# EAGLE schematic MM-Qwiic-Snap-1x1 (EAGLE 9.6.2)
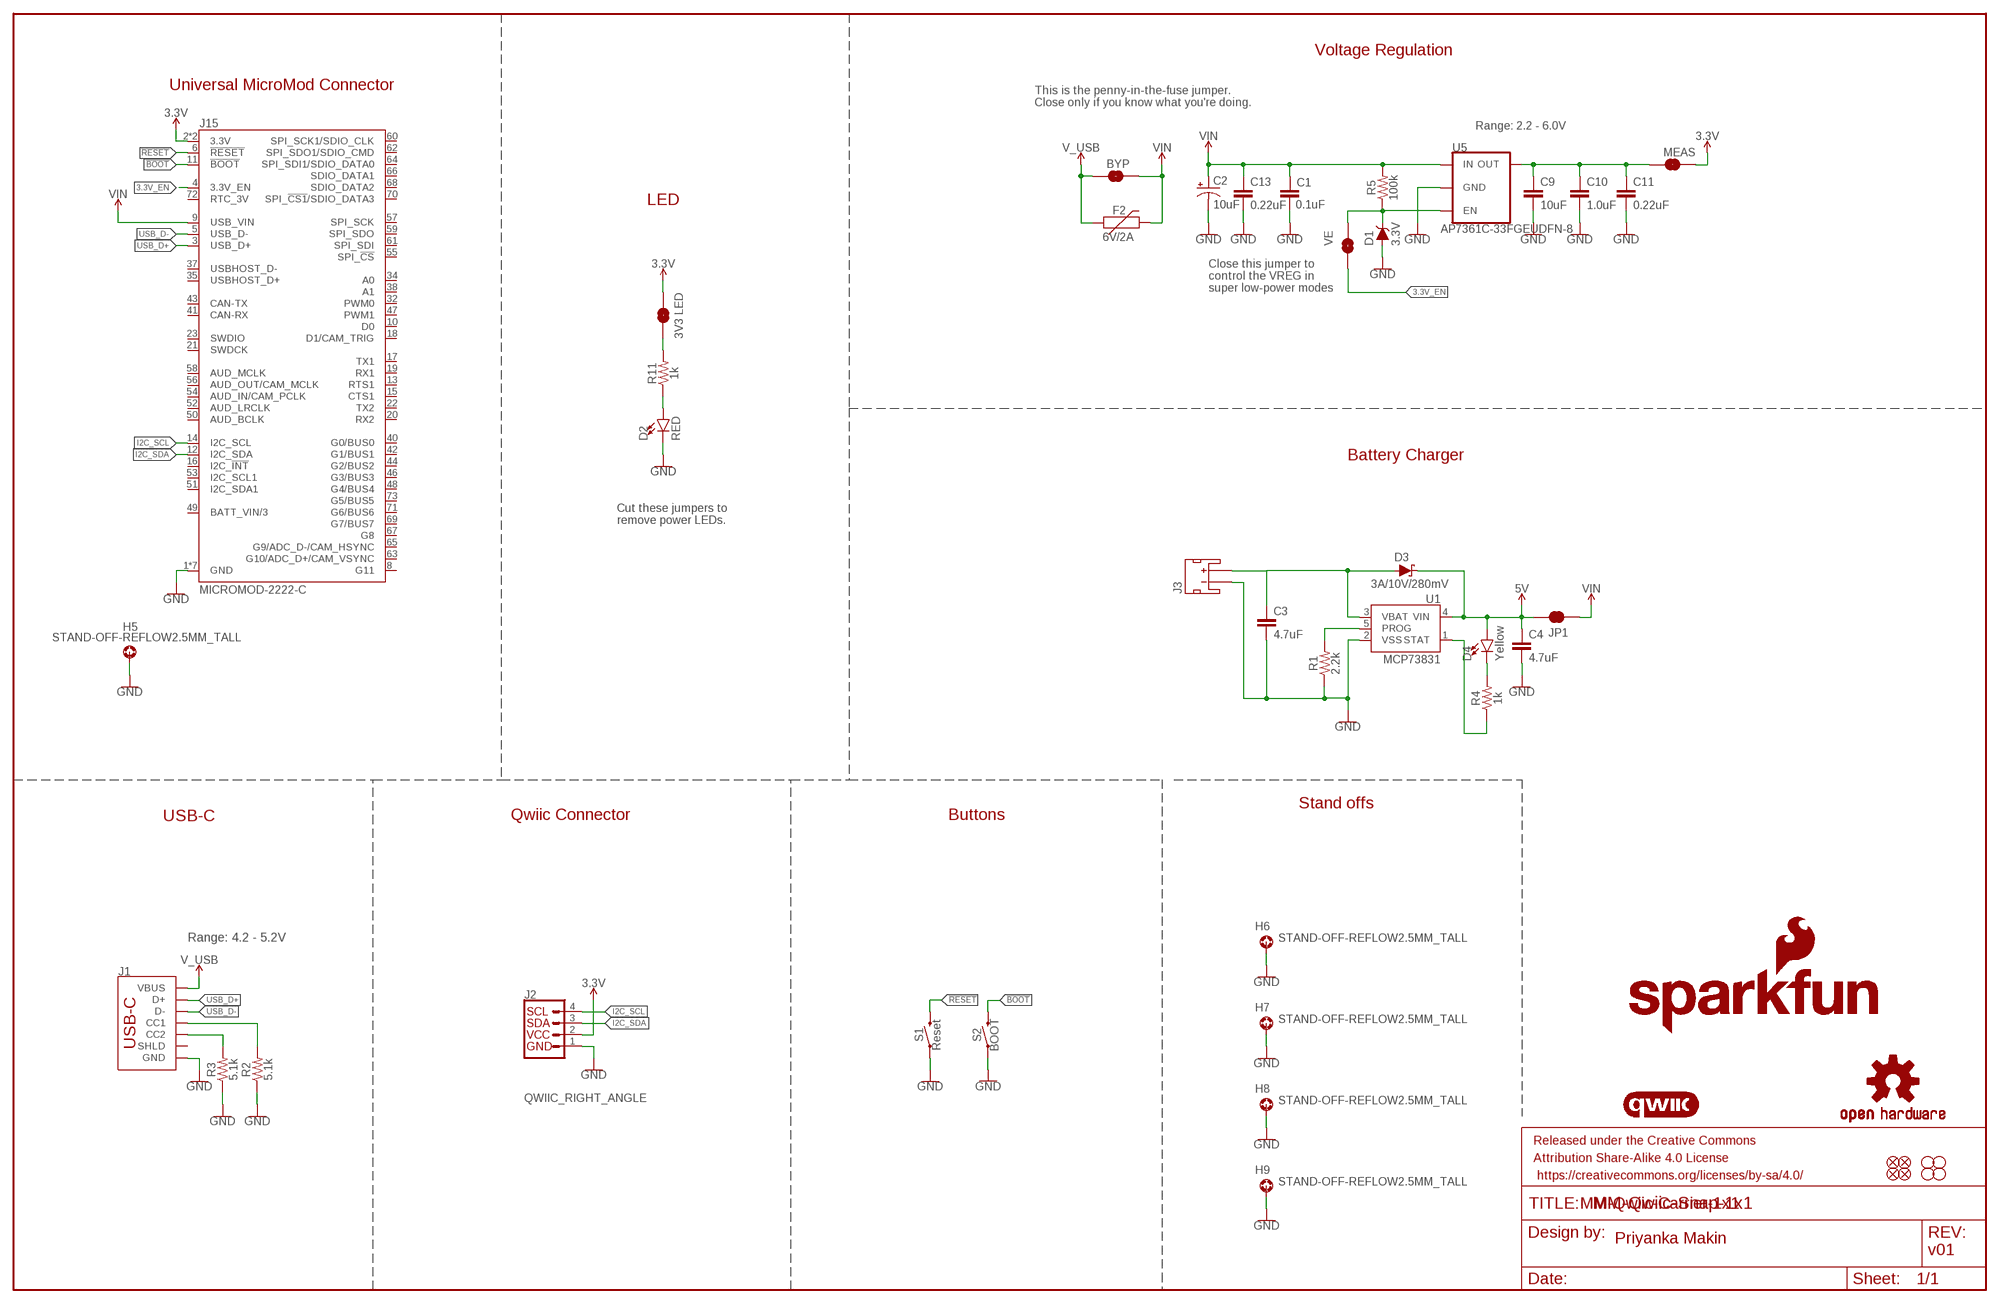
[diagram p0: schematic, sheet 1]

## Parts
BYP  JUMPER-SMT_2_NO_SILK  [SMT-JUMPER_2_NO_SILK]
C1  0.1uF  0.1UF-0603-25V-(+80/-20%)  [0603]
C2  10uF  10UF-POLAR-EIA3216-16V-10%(TANT)  [EIA3216]
C3  4.7uF  4.7UF-0603-35V-(20%)  [0603]
C4  4.7uF  4.7UF-0603-35V-(20%)  [0603]
C9  10uF  10UF-0603-6.3V-20%  [0603]
C10  1.0uF  1.0UF-0603-16V-10%  [0603]
C11  0.22uF  0.22UF-0603-25V-10%  [0603]
C13  0.22uF  0.22UF-0603-25V-10%  [0603]
D1  3.3V  DIODE-ZENER-MM3Z3V3T1G  [SOD-323]
D2  RED  LED-RED0603  [LED-0603]
D3  3A/10V/280mV  DIODE-SCHOTTKY-BAT60A  [SOD-323]
D4  Yellow  LED-YELLOW0603  [LED-0603]
F2  6V/2A  PPTC_6V2A  [1210]
FD1  FIDUCIALUFIDUCIAL  [FIDUCIAL-MICRO]
FD2  FIDUCIALUFIDUCIAL  [FIDUCIAL-MICRO]
FD3  FIDUCIALUFIDUCIAL  [FIDUCIAL-MICRO]
FD4  FIDUCIALUFIDUCIAL  [FIDUCIAL-MICRO]
FRAME1  FRAME-LEDGER  [CREATIVE_COMMONS]
H1  STAND-OFF  [STAND-OFF]
H2  STAND-OFF  [STAND-OFF]
H3  STAND-OFF  [STAND-OFF]
H4  STAND-OFF  [STAND-OFF]
H5  STAND-OFF-REFLOW2.5MM_TALL  [STAND-OFF-REFLOW-M2.5]
H6  STAND-OFF-REFLOW2.5MM_TALL  [STAND-OFF-REFLOW-M2.5]
H7  STAND-OFF-REFLOW2.5MM_TALL  [STAND-OFF-REFLOW-M2.5]
H8  STAND-OFF-REFLOW2.5MM_TALL  [STAND-OFF-REFLOW-M2.5]
H9  STAND-OFF-REFLOW2.5MM_TALL  [STAND-OFF-REFLOW-M2.5]
J1  USB_C_2-LAYER_PADS  [USB-C-16P-2LAYER-PADS]
J2  QWIIC_RIGHT_ANGLE  QWIIC_CONNECTORJS-1MM  [JST04_1MM_RA]
J3  JST_2MM_MALE  [JST-2-SMD]
J15  MICROMOD-2222-C  [M.2-CONNECTOR-E]
JP1  JUMPER-SMT_2_NC_TRACE_SILK  [SMT-JUMPER_2_NC_TRACE_SILK]
JP4  3V3 LED  JUMPER-SMT_2_NC_TRACE_SILK  [SMT-JUMPER_2_NC_TRACE_SILK]
JP6  VE  JUMPER-SMT_2_NO_SILK  [SMT-JUMPER_2_NO_SILK]
LOGO1  SFE_LOGO_NAME_FLAME.2_INCH  [SFE_LOGO_NAME_FLAME_.2]
LOGO2  QWIIC_LOGO_CONNECTOR  [QWIIC_5.5MM]
LOGO3  OSHW-LOGOM  [OSHW-LOGO-M]
MEAS  JUMPER-COMBO_2_NC_TRACE  [COMBO-JUMPER_2_NC_TRACE]
R1  2.2k  2.2KOHM-0603-1/10W-1%  [0603]
R2  5.1k  5.1KOHM5.1KOHM-0603-1/10W-1%  [0603]
R3  5.1k  5.1KOHM5.1KOHM-0603-1/10W-1%  [0603]
R4  1k  1KOHM-0603-1/10W-1%  [0603]
R5  100k  100KOHM-0603-1/10W-1%  [0603]
R11  1k  1KOHM-0603-1/10W-1%  [0603]
S1  Reset  MOMENTARY-SWITCH-SPST-SMD-5.2-TALL-REDUNDANT  [TACTILE_SWITCH_SMD_5.2MM]
S2  BOOT  MOMENTARY-SWITCH-SPST-SMD-5.2-TALL-REDUNDANT  [TACTILE_SWITCH_SMD_5.2MM]
U1  MCP73831  [SOT23-5]
U5  AP7361C-33FGEUDFN-8  [UDFN-8]

## Nets
3.3V: J2.2 J15.2(3.3V) J15.74(3.3V) JP4.2 MEAS.2 MEAS.4
3.3V_EN: J15.4(3.3V_EN) JP6.1
5V: C4.1 D3.C D4.A JP1.2 U1.4(VIN)
!BOOT!: J15.11(!BOOT!) S2.3 S2.4
!RESET!: J15.6(!RESET!) S1.3 S1.4
GND: C1.2 C2.- C3.2 C4.2 C9.2 C10.2 C11.2 C13.2 D1.A D2.C H5.1 H6.1 H7.1 H8.1 H9.1 J1.GND J1.GND2(GND) J2.1 J3.1(-) J15.1(GND) J15.7(GND) J15.33(GND) J15.36(GND) J15.39(GND) J15.45(GND) J15.75(GND) R1.1 R2.1 R3.1 S1.1 S1.2 S2.1 S2.2 U1.2(VSS) U5.4(GND) U5.EP(GND)
I2C_SCL: J2.4 J15.14(I2C_SCL)
I2C_SDA: J2.3 J15.12(I2C_SDA)
N$1: C9.1 C10.1 C11.1 MEAS.1 MEAS.3 U5.1(OUT)
N$2: R1.2 U1.5(PROG)
N$3: R4.1 U1.1(STAT)
N$4: JP4.1 R11.2
N$5: C3.1 D3.A J3.2(+) U1.3(VBAT)
N$6: D2.A R11.1
N$8: D4.C R4.2
N$10: J1.A5(CC1) R2.2
N$11: J1.B5(CC2) R3.2
USB_D+: J1.A6(D+) J1.B6(D+) J15.3(USB_D+)
USB_D-: J1.A7(D-) J1.B7(D-) J15.5(USB_D-)
V_USB: BYP.1 F2.1 J1.VBUS1(VBUS) J1.VBUS2(VBUS)
VIN: BYP.2 C1.1 C2.+ C13.1 F2.2 J15.9(USB_VIN) JP1.1 R5.2 U5.8(IN)
VREG_EN: D1.C JP6.2 R5.1 U5.5(EN)
Unconnected: J1.SHLD1(SHLD) J1.SHLD2(SHLD) J1.SHLD3(SHLD) J1.SHLD4(SHLD) J3.NC1(PAD1) J3.NC2(PAD2) J15.8(G11) J15.10(D0) J15.13(RTS1) J15.15(CTS1) J15.16(I2C_!INT!) J15.17(TX1) J15.18(D1/CAM_TRIG) J15.19(RX1) J15.20(RX2) J15.21(SWDCK) J15.22(TX2) J15.23(SWDIO) J15.32(PWM0) J15.34(A0) J15.35(USBHOST_D+) J15.37(USBHOST_D-) J15.38(A1) J15.40(G0/BUS0) J15.41(CAN-RX) J15.42(G1/BUS1) J15.43(CAN-TX) J15.44(G2/BUS2) J15.46(G3/BUS3) J15.47(PWM1) J15.48(G4/BUS4) J15.49(BATT_VIN/3) J15.50(AUD_BCLK) J15.51(I2C_SDA1) J15.52(AUD_LRCLK) J15.53(I2C_SCL1) J15.54(AUD_IN/CAM_PCLK) J15.55(SPI_!CS!) J15.56(AUD_OUT/CAM_MCLK) J15.57(SPI_SCK) J15.58(AUD_MCLK) J15.59(SPI_SDO) J15.60(SPI_SCK1/SDIO_CLK) J15.61(SPI_SDI) J15.62(SPI_SDO1/SDIO_CMD) J15.63(G10/ADC_D+/CAM_VSYNC) J15.64(SPI_SDI1/SDIO_DATA0) J15.65(G9/ADC_D-/CAM_HSYNC) J15.66(SDIO_DATA1) J15.67(G8) J15.68(SDIO_DATA2) J15.69(G7/BUS7) J15.70(SPI_!CS1!/SDIO_DATA3) J15.71(G6/BUS6) J15.72(RTC_3V) J15.73(G5/BUS5)

## Notes on the sheet
- Voltage Regulation
- Universal MicroMod Connector
- This is the penny-in-the-fuse jumper.
  Close only if you know what you're doing.
- Range: 2.2 - 6.0V
- LED
- Close this jumper to 
  control the VREG in 
  super low-power modes
- Battery Charger
- Cut these jumpers to
  remove power LEDs.
- Stand offs
- USB-C | Qwiic Connector | Buttons
- Range: 4.2 - 5.2V
- MM-Qwiic-Carrier-1x1
- Priyanka Makin
- v01

## Library data of the parts
BYP JP6 = SparkFun-Jumpers:JUMPER-SMT_2_NO: Normally open jumper This jumper has two pads in close proximity to each other. Apply solder to close the connection. Round pads are easier to solder for beginners, but are a lot larger. SparkFun Product that uses the round pads: SparkFun EL Sequencer <https://www.sparkfun.com/products/12781>
C1 = SparkFun-Capacitors:0.1UF: 0.1µF ceramic capacitors A capacitor is a passive two-terminal electrical component used to store electrical energy temporarily in an electric field.; PROD_ID: CAP-00810
C2 = SparkFun-Capacitors:10UF-POLAR: 10.0µF polarized capacitors A capacitor is a passive two-terminal electrical component used to store electrical energy temporarily in an electric field.; PROD_ID: CAP-00811
C3 C4 = SparkFun-Capacitors:4.7UF: 4.7µF ceramic capacitors A capacitor is a passive two-terminal electrical component used to store electrical energy temporarily in an electric field.; PROD_ID: CAP-14106
C9 = SparkFun-Capacitors:10UF: 10.0µF ceramic capacitors A capacitor is a passive two-terminal electrical component used to store electrical energy temporarily in an electric field.; PROD_ID: CAP-11015
C10 = SparkFun-Capacitors:1.0UF: 1µF ceramic capacitors A capacitor is a passive two-terminal electrical component used to store electrical energy temporarily in an electric field.; PROD_ID: CAP-00868
C11 C13 = SparkFun-Capacitors:0.22UF: 0.22µF ceramic capacitors A capacitor is a passive two-terminal electrical component used to store electrical energy temporarily in an electric field.; PROD_ID: CAP-07822
D1 = SparkFun-DiscreteSemi:DIODE-ZENER: Zener Diode A Zener diode allows current to flow from its anode to its cathode like a normal semiconductor diode, but it also permits current to flow in the reverse direction when its "Zener voltage" is reached. - WIkipedia; PROD_ID: DIO-11284
D2 = SparkFun-LED:LED-RED: Red SMD LED Used in manufacturing of most products at SparkFun Packages: 0603 - SMD 0603 package [Product Link] <http://docs.avagotech.com/docs/AV02-0551EN> 0603 SMART - SMD 0603 SMART package ( more efficient and expensive)[Product Link] <http://www.osram-os.com/Graphics/XPic2/00077099_0.pdf> 1206 - SMD1206 package [Product Link] <https://www.sparkfun.com/datasheets/DevTools/LilyPad/Q150OVS4.pdff> SparkFun Products: Pro Mini 328 -5V <https://www.sparkfun.com/products/821> RedBoard <https://www.sparkfun.com/products/12757> IOIO-OTG <https://www.sparkfun.com/products/13613>; PROD_ID: DIO-00819
D3 = SparkFun-DiscreteSemi:DIODE-SCHOTTKY: Schottky diode A Schottky diode is a semiconductor diode which has a low forward voltage drop and a very fast switching action.; PROD_ID: DIO-14072
D4 = SparkFun-LED:LED-YELLOW: Yellow SMD LED Used in manufacturing several products at SparkFun. Packages: 0603 - SMD 0603 package[Product Link] <http://www.kingbrightusa.com/product.asp?catalog_name=LED&product_id=APT1608SYCK> 0603 -SMART - SMART SMD 0603 package (more efficient/more expensive) [Product Link] <http://www.osram-os.com/osram_os/en/products/product-catalog/led-light-emitting-diodes/smartled-0603/ly-l29k/index.jsp> LilyPad - SMD1206 package[Product Datasheet] <https://www.sparkfun.com/datasheets/DevTools/LilyPad/Q150YUS4.pdf> SparkFun Products: Blynk Board <https://www.sparkfun.com/products/13794> IOIO-OTG <https://www.sparkfun.com/products/13613> XBee Explorer Serial <https://www.sparkfun.com/products/13225>; PROD_ID: DIO-09003
F2 = SparkFun-Fuses:PPTC: Resettable Fuse PPTC Resettable Fuse. Really a sort of resistor with a polymeric positive temperature coefficient whose resistance increases dramatically with an increase in temperature. When heated by the power passing through the resistance rises causing the current to be limited, protecting the circuit. This is achieved by the transition of the polymer from a crystalline to an amorphous state where the conductive carbon separates breaking the conductive pathways found in the cool crystalline structure. When a PPTC cools back down it resumes conducting letting the circuit turn back on. SparkFun Products: SparkFun RedBoard - Programmed with Arduino <https://www.sparkfun.com/products/12757> Pro Micro - 5V/16MHz <https://www.sparkfun.com/products/12640> Arduino Pro 328 - 5V/16MHz <https://www.sparkfun.com/products/10915> MP3 Trigger <https://www.sparkfun.com/products/13720>; PROD_ID: RES-14313
FD1-FD4 = SparkFun-Aesthetics:FIDUCIAL: Fiducial Alignment Points Point-of-reference for pick-and-place machines and other optical instruments.
FRAME1 = SparkFun-Aesthetics:FRAME-LEDGER: Schematic Frame - Ledger Standard 11x14 US Ledger frame
H1-H4 = SparkFun-Hardware:STAND-OFF: Stand Off Drill holes for mechanically mounting via screws, standoffs, etc. Note: Use the keepout ring to avoid running the screw head into surrounding components. Variant Overviews STAND-OFF - Mechanical footprint for a #4 phillips button head screw. STAND-OFF-TIGHT - Mechanical footprint for a #4 phillips button head screw, Example SparkFun Products Screw - Phillips Head (1/4", 4-40, 10 pack) <https://www.sparkfun.com/products/10453> (PRT-10453) Screw - Phillips Head (1/2", 4-40, 10 pack) <https://www.sparkfun.com/products/10452> (PRT-10452) Screw - Phillips Head (3/4", 4-40, 10 pack) <https://www.sparkfun.com/products/10451> (PRT-10451) Screw - Phillips Head (1", 4-40, 10 pack) <https://www.sparkfun.com/products/10450> (PRT-10450)
H5-H9 = SparkFun-Hardware:STAND-OFF-REFLOW: Stand Off Reflow Compatible A metal standoff that can be placed and reflowed onto a PCB.; PROD_ID: HW-14899
J1 = SparkFun-Connectors:USB_C: USB Type C 16Pin Connector Super Speed pins not available on the 16-pin purely SMD connector so this part is best for USB 2.0 implementations. D1 and D2 are tied together enabling D+/- no matter which way the cable is plugged into the connector. The two channel configuration pins (CC1/2) are exposed. These are normally connected to ground via 5.1k resistors but can be reconfigured for high current/high power applications.; PROD_ID: CONN-14122
J2 = SparkFun-Connectors:QWIIC_CONNECTOR: SparkFun I2C Standard Qwiic Connector An SMD 1mm pitch JST connector makes it easy and quick (get it? Qwiic?) to connect I2C devices to each other. The Qwiic system <http://www.sparkfun.com/qwiic> enables fast and solderless connection between popular platforms and various sensors and actuators. We carry 200mm <https://www.sparkfun.com/products/14204>, 100mm <https://www.sparkfun.com/products/14205>, 50mm <https://www.sparkfun.com/products/14206>, and breadboard friendly <https://www.sparkfun.com/products/14207> Qwiic cables. We also offer 10 pcs strips <https://www.sparkfun.com/products/14323> the SMD connectors.; PROD_ID: CONN-13694
J3 = SparkFun-Connectors:JST_2MM_MALE: JST 2MM MALE RA CONNECTOR Two pin, compact surface mount connector. Commonly used as a battery input connection point. We really like the solid locking feeling and high current rating on these small connectors. We use these all the time as battery connectors. Mates to single-cell LiPo batteries. Here is the connector we sell at SparkFun: JST Right Angle Connector - White <https://www.sparkfun.com/products/8612> (PRT-08612) Datasheet <http://www.sparkfun.com/datasheets/Prototyping/Connectors/JST-Horizontal.pdf> It was used on these SparkFun products: SparkFun MOSFET Power Controller <https://www.sparkfun.com/products/11214> (PRT-11214) SparkFun Battery Babysitter - LiPo Battery Manager <https://www.sparkfun.com/products/13777> (PRT-13777) And many, many others that required a lipo battery connection.; PROD_ID: CONN-11443; SF_ID: PRT-08612
J15 = SparkFun-MicroMod:MICROMOD: MicroMod Connector Description: A card edge connector and mating PCB connector to allow various MicroMod Processor Boards to be coupled with various carrier boards of different capabilities. Based on the M.2 standard.; PROD_ID: CONN-14877
JP1 JP4 = SparkFun-Jumpers:JUMPER-SMT_2_NC_TRACE: Normally closed trace jumper This jumper has a trace between two pads so it's normally closed (NC). Use a razor knife to open the connection. For best results follow the IPC guidelines for cutting traces: Cutout at least 0.063 mm (0.005 in). Remove all loose material to clean up the cut area. Seal the cut with an approved epoxy. Reapply solder to reclose the connection.
LOGO1 = SparkFun-Aesthetics:SFE_LOGO_NAME_FLAME: SparkFun Font Logo w/ Flame This is the SparkFun full logo. The logo on the schematic will always be the same size; the package variant is the height of the flame part of the logo. Default layer for the logo on the board is tSilk.
LOGO2 = SparkFun-Aesthetics:QWIIC_LOGO: Qwiic Logos for placement on schematic and PCB. The 5.5mm silk logo is best for placing next to Qwiic connector.
LOGO3 = SparkFun-Aesthetics:OSHW-LOGO: Open-Source Hardware (OSHW) Logo This logo indicates the piece of hardware it is found on incorporates a OSHW license and/or adheres to the definition of open source hardware found here: http://freedomdefined.org/OSHW
MEAS = SparkFun-Jumpers:JUMPER-COMBO_2_NC_TRACE
R1 = SparkFun-Resistors:2.2KOHM: 2.2kΩ resistor A resistor is a passive two-terminal electrical component that implements electrical resistance as a circuit element. Resistors act to reduce current flow, and, at the same time, act to lower voltage levels within circuits. - Wikipedia; PROD_ID: RES-08272
R2 R3 = SparkFun-Resistors:5.1KOHM; PROD_ID: RES-12083
R4 R11 = SparkFun-Resistors:1KOHM: 1kΩ resistor A resistor is a passive two-terminal electrical component that implements electrical resistance as a circuit element. Resistors act to reduce current flow, and, at the same time, act to lower voltage levels within circuits. - Wikipedia; PROD_ID: RES-07856
R5 = SparkFun-Resistors:100KOHM: 100kΩ resistor A resistor is a passive two-terminal electrical component that implements electrical resistance as a circuit element. Resistors act to reduce current flow, and, at the same time, act to lower voltage levels within circuits. - Wikipedia; PROD_ID: RES-07828
S1 S2 = SparkFun-Switches:MOMENTARY-SWITCH-SPST: Momentary Switch (Pushbutton) - SPST Normally-open (NO) SPST momentary switches (buttons, pushbuttons). Variants PTH-12MM - 12mm square, through-hole Momentary Pushbutton Switch - 12mm Square <https://www.sparkfun.com/products/9190> (COM-09190) PTH-6.0MM, PTH-6.0MM-KIT - 6.0mm square, through-hole Mini Pushbutton Switch <https://www.sparkfun.com/products/97> (COM-00097) KIT package intended for soldering kit's - only one side of pads' copper is exposed. PTH-RIGHT-ANGLE-KIT - Right-angle, through-hole Right Angle Tactile Button <https://www.sparkfun.com/products/10791> - Used on SparkFun BigTime Watch Kit <https://www.sparkfun.com/products/11734> SMD-12MM - 12mm square, surface-mount Tactile Button - SMD (12mm) <https://www.sparkfun.com/products/12993> (COM-12993) Used on SparkFun PicoBoard <https://www.sparkfun.com/products/11888> SMD-4.5MM - 4.5mm Square Trackball Switch Used on SparkFun Blackberry Trackballer Breakout <https://www.sparkfun.com/products/13169> SMD-4.6MMX2.8MM - 4.60mm x 2.80mm, surface mount Used on SparkFun SAMD21 Mini Breakout <https://www.sparkfun.com/products/13664> SMD-5.2MM, SMD-5.2-REDUNDANT - 5.2mm square, surface-mount Mini Pushbutton Switch - SMD <https://www.sparkfun.com/products/8720> (COM-08720) Used on Arduino Pro Mini <https://www.sparkfun.com/products/11114> REDUNDANT package connects both switch circuits together SMD-6.0X3.5MM - 6.0 x 3.5mm, surface mount Momentary Reset Switch SMD <https://www.sparkfun.com/products/8229> (COM-08229) SMD-6.2MM-TALL - 6.2mm square, surface mount Tactile Button - SMD (6mm) <https://www.sparkfun.com/products/12992> Used on SparkFun Digital Sandbox <https://www.sparkfun.com/products/12651> SMD-RIGHT-ANGLE - Right-angle, surface mount Used on SparkFun Block for Intel® Edison - Arduino <https://www.sparkfun.com/products/13036>; PROD_ID: SWCH-14139
U1 = SparkFun-IC-Power:MCP73831: MCP73831T Li-Ion, Li-Pol Controller Miniature single cell, fully integrated Li-Ion, Li-polymer charge management controller Datasheet <http://ww1.microchip.com/downloads/en/DeviceDoc/20001984g.pdf> SparkFun Products: SparkFun ESP32 Thing <https://www.sparkfun.com/products/13907> SparkFun 9DoF Razor IMU M0 <https://www.sparkfun.com/products/14001>; PROD_ID: IC-09995
U5 = SparkFun-IC-Power:AP7361C-33FGE: AP7361C 3.3V LDO Regulator; PROD_ID: VREG-14094

## Net classes
0 default: width 0 mm, drill 0 mm
1 power: width 0.762 mm